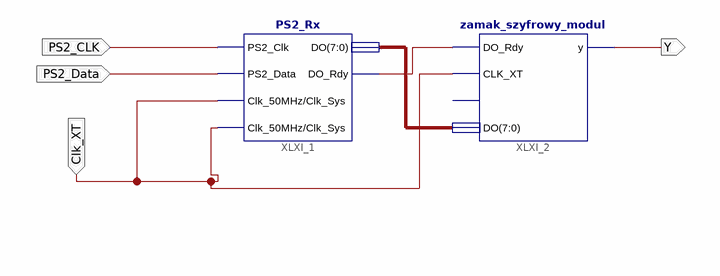
[diagram p0: schematic sheet 1]
// Xilinx ISE schematic sch.sch (spartan3e) as structural Verilog: 2 symbols, 4 ports
module sch (
  input  PS2_CLK,
  input  PS2_Data,
  input  Clk_XT,
  output Y
);

  wire XLXN_6;
  wire [7:0] XLXN_7;

  PS2_Rx XLXI_1 (
    .PS2_Clk(PS2_CLK), .PS2_Data(PS2_Data), .Clk_50MHz(Clk_XT), .Clk_Sys(Clk_XT), .DO_Rdy(XLXN_6), .DO(XLXN_7));
  zamak_szyfrowy_modul XLXI_2 (.DO_Rdy(XLXN_6), .CLK_XT(Clk_XT), .DO(XLXN_7), .y(Y));  // open: RST
endmodule
